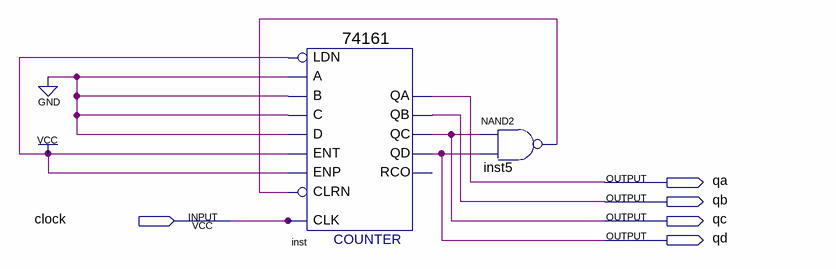
[diagram p0: schematic sheet]
// Quartus schematic mytest5.bdf as structural Verilog: 2 symbols, 5 pins
module mytest5 (
  input  clock,
  output qa,
  output qb,
  output qc,
  output qd
);

  wire inst5_out;

  \74161  inst (
    .CLRN(inst5_out), .CLK(clock), .ENP(1'b1), .LDN(1'b1), .A(1'b0), .D(1'b0), .ENT(1'b1), .B(1'b0),
    .C(1'b0), .QD(qd), .QC(qc), .QB(qb), .QA(qa));  // open: RCO
  nand inst5 (inst5_out, qc, qd);
endmodule
